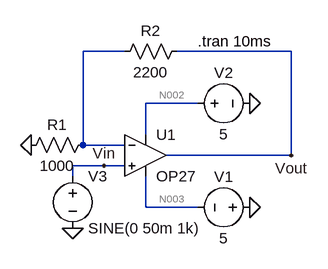
[diagram p0: schematic circuit-2.asc]
circuit-2.asc, the LTspice schematic file:
Version 4.1
SHEET 1 880 680
WIRE 192 -112 128 -112
WIRE 448 -112 272 -112
WIRE 304 -32 224 -32
WIRE 224 16 224 -32
WIRE 128 32 128 -112
WIRE 192 32 128 32
WIRE 448 48 448 -112
WIRE 448 48 256 48
WIRE 160 64 112 64
WIRE 192 64 160 64
WIRE 112 80 112 64
WIRE 224 128 224 80
WIRE 304 128 224 128
FLAG 384 -32 0
FLAG 384 128 0
FLAG 48 32 0
FLAG 112 160 0
FLAG 448 48 Vout
FLAG 160 64 Vin
SYMBOL OpAmps\\OP27 224 -16 R0
SYMATTR InstName U1
SYMBOL voltage 400 128 R90
WINDOW 0 -32 56 VBottom 2
WINDOW 3 32 56 VTop 2
WINDOW 123 0 0 Left 0
WINDOW 39 0 0 Left 0
SYMATTR InstName V1
SYMATTR Value 5
SYMBOL voltage 288 -32 R270
WINDOW 0 32 56 VTop 2
WINDOW 3 -32 56 VBottom 2
WINDOW 123 0 0 Left 0
WINDOW 39 0 0 Left 0
SYMATTR InstName V2
SYMATTR Value 5
SYMBOL res 144 16 R90
WINDOW 0 0 56 VBottom 2
WINDOW 3 32 56 VTop 2
SYMATTR InstName R1
SYMATTR Value 1000
SYMBOL res 288 -128 R90
WINDOW 0 0 56 VBottom 2
WINDOW 3 32 56 VTop 2
SYMATTR InstName R2
SYMATTR Value 2200
SYMBOL voltage 112 64 R0
WINDOW 123 0 0 Left 0
WINDOW 39 0 0 Left 0
SYMATTR InstName V3
SYMATTR Value SINE(0 50m 1k)
TEXT 304 -128 Left 2 !.tran 10ms

The netlist it stands for:
* circuit-2.asc
X§U1 Vin N001 N002 N003 Vout OP27  ; pins In+ In- V+ V- OUT
V1 0 N003 5
V2 N002 0 5
R1 N001 0 1000
R2 Vout N001 2200
V3 Vin 0 SINE(0 50m 1k)
.tran 10ms
.lib ADI.lib
.backanno
.end

* Results of the author's LTspice run, read from the files saved beside the schematic
* Operating Point, zero values left out:
*   V(n002) = 5 V
*   V(n003) = -5 V
*   I(V1) = -2.468 mA
*   I(V2) = -2.468 mA
*   Ix(u1:3) = 2.468 mA
*   Ix(u1:4) = -2.468 mA
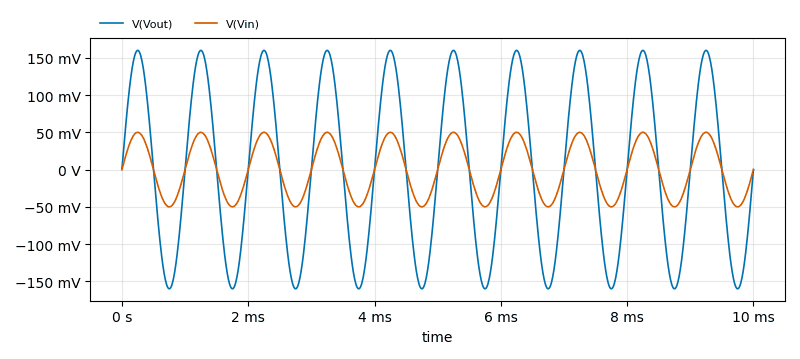
[diagram p1: Transient Analysis of circuit-2.asc, plotted from the saved traces]
* Transient Analysis, 1 run:
*   V(Vout): min -160 mV, max 160 mV, average 0 V, rms 113.1 mV, last -60.56 µV
*   V(Vin): min -50 mV, max 50 mV, average 0 V, rms 35.36 mV, last 0 V